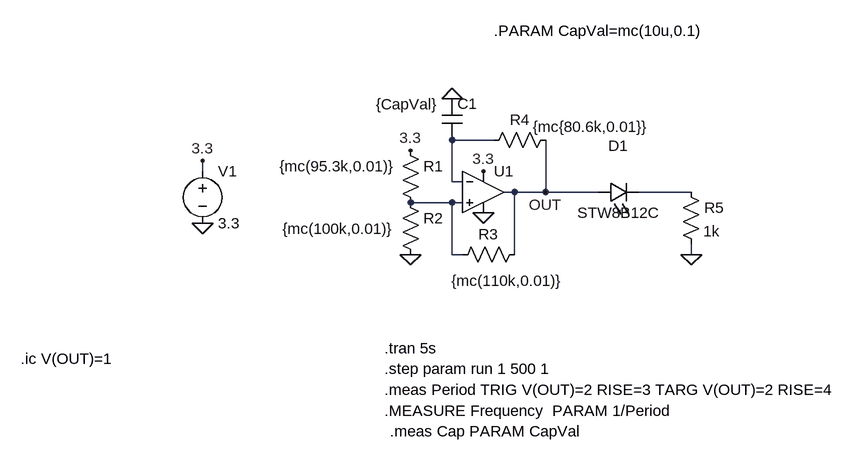
[diagram p0: schematic Draft2.asc]
Draft2.asc, the LTspice schematic file:
Version 4
SHEET 1 880 680
WIRE 240 96 176 96
WIRE -208 144 -208 128
WIRE 176 160 176 96
WIRE 192 160 176 160
WIRE 272 176 256 176
WIRE 320 176 320 96
WIRE 320 176 272 176
WIRE 400 176 320 176
WIRE 544 176 464 176
WIRE 176 192 112 192
WIRE 192 192 176 192
WIRE 176 272 176 192
WIRE 192 272 176 272
WIRE 272 272 272 176
WIRE 544 272 544 256
FLAG -208 224 0
FLAG -208 128 3.3
FLAG 224 144 3.3
FLAG 224 208 0
FLAG 112 272 0
FLAG 112 112 3.3
FLAG 176 32 0
FLAG 320 176 OUT
FLAG 544 272 0
SYMBOL Opamps\\UniversalOpamp2 224 176 R0
SYMATTR InstName U1
SYMBOL voltage -208 128 R0
WINDOW 123 0 0 Left 2
WINDOW 39 0 0 Left 2
SYMATTR InstName V1
SYMATTR Value 3.3
SYMBOL res 96 96 R0
WINDOW 3 -186 40 Left 2
SYMATTR InstName R1
SYMATTR Value {mc(95.3k,0.01)}
SYMBOL res 96 176 R0
WINDOW 3 -181 56 Left 2
SYMATTR InstName R2
SYMATTR Value {mc(100k,0.01)}
SYMBOL res 288 256 R90
WINDOW 0 0 56 VBottom 2
WINDOW 3 41 27 VTop 2
SYMATTR InstName R3
SYMATTR Value {mc(110k,0.01)}
SYMATTR SpiceLine tol=1 pwr=0.1
SYMBOL cap 160 32 R0
WINDOW 3 -101 9 Left 2
SYMATTR InstName C1
SYMATTR Value {CapVal}
SYMBOL res 336 80 R90
WINDOW 0 0 56 VBottom 2
WINDOW 3 -20 -54 VTop 2
SYMATTR InstName R4
SYMATTR Value {mc{80.6k,0.01}}
SYMBOL LED 400 192 R270
WINDOW 0 72 32 VTop 2
WINDOW 3 0 32 VBottom 2
SYMATTR InstName D1
SYMATTR Value STW8B12C
SYMBOL res 528 160 R0
WINDOW 3 35 76 Left 2
SYMATTR InstName R5
SYMATTR Value 1k
TEXT 72 416 Left 2 !.tran 5s
TEXT -488 432 Left 2 !.ic V(OUT)=1
TEXT 72 448 Left 2 !.step param run 1 500 1
TEXT 72 480 Left 2 !.meas Period TRIG V(OUT)=2 RISE=3 TARG V(OUT)=2 RISE=4
TEXT 240 -72 Left 2 !.PARAM CapVal=mc(10u,0.1)
TEXT 72 512 Left 2 !.MEASURE Frequency  PARAM 1/Period
TEXT 80 544 Left 2 !.meas Cap PARAM CapVal

The netlist it stands for:
* Draft2.asc
XU1 N003 N001 3.3 0 OUT level.2 Avol=1Meg GBW=10Meg Slew=10Meg ilimit=25m rail=0 Vos=0 phimargin=45 en=0 enk=0 in=0 ink=0 Rin=500Meg  ; pins IN+ IN- V+ V- OUT
V1 3.3 0 3.3
R1 3.3 N003 {mc(95.3k,0.01)}
R2 N003 0 {mc(100k,0.01)}
R3 OUT N003 {mc(110k,0.01)} tol=1 pwr=0.1
C1 0 N001 {CapVal}
R4 OUT N001 {mc{80.6k,0.01}}
D1 OUT N002 STW8B12C
R5 N002 0 1k
.model D D
.lib standard.dio
.tran 5s
.ic V(OUT)=1
.step param run 1 500 1
.meas Period TRIG V(OUT)=2 RISE=3 TARG V(OUT)=2 RISE=4
.PARAM CapVal=mc(10u,0.1)
.MEASURE Frequency  PARAM 1/Period
.meas Cap PARAM CapVal
.lib UniversalOpamps2.sub
.backanno
.end